# EasyEDA schematic DOAN1.json
TITLE: Gamepad; REV: 1.0; Date: 2023-03-11; Sheet: 1/1; Company: DOAN1
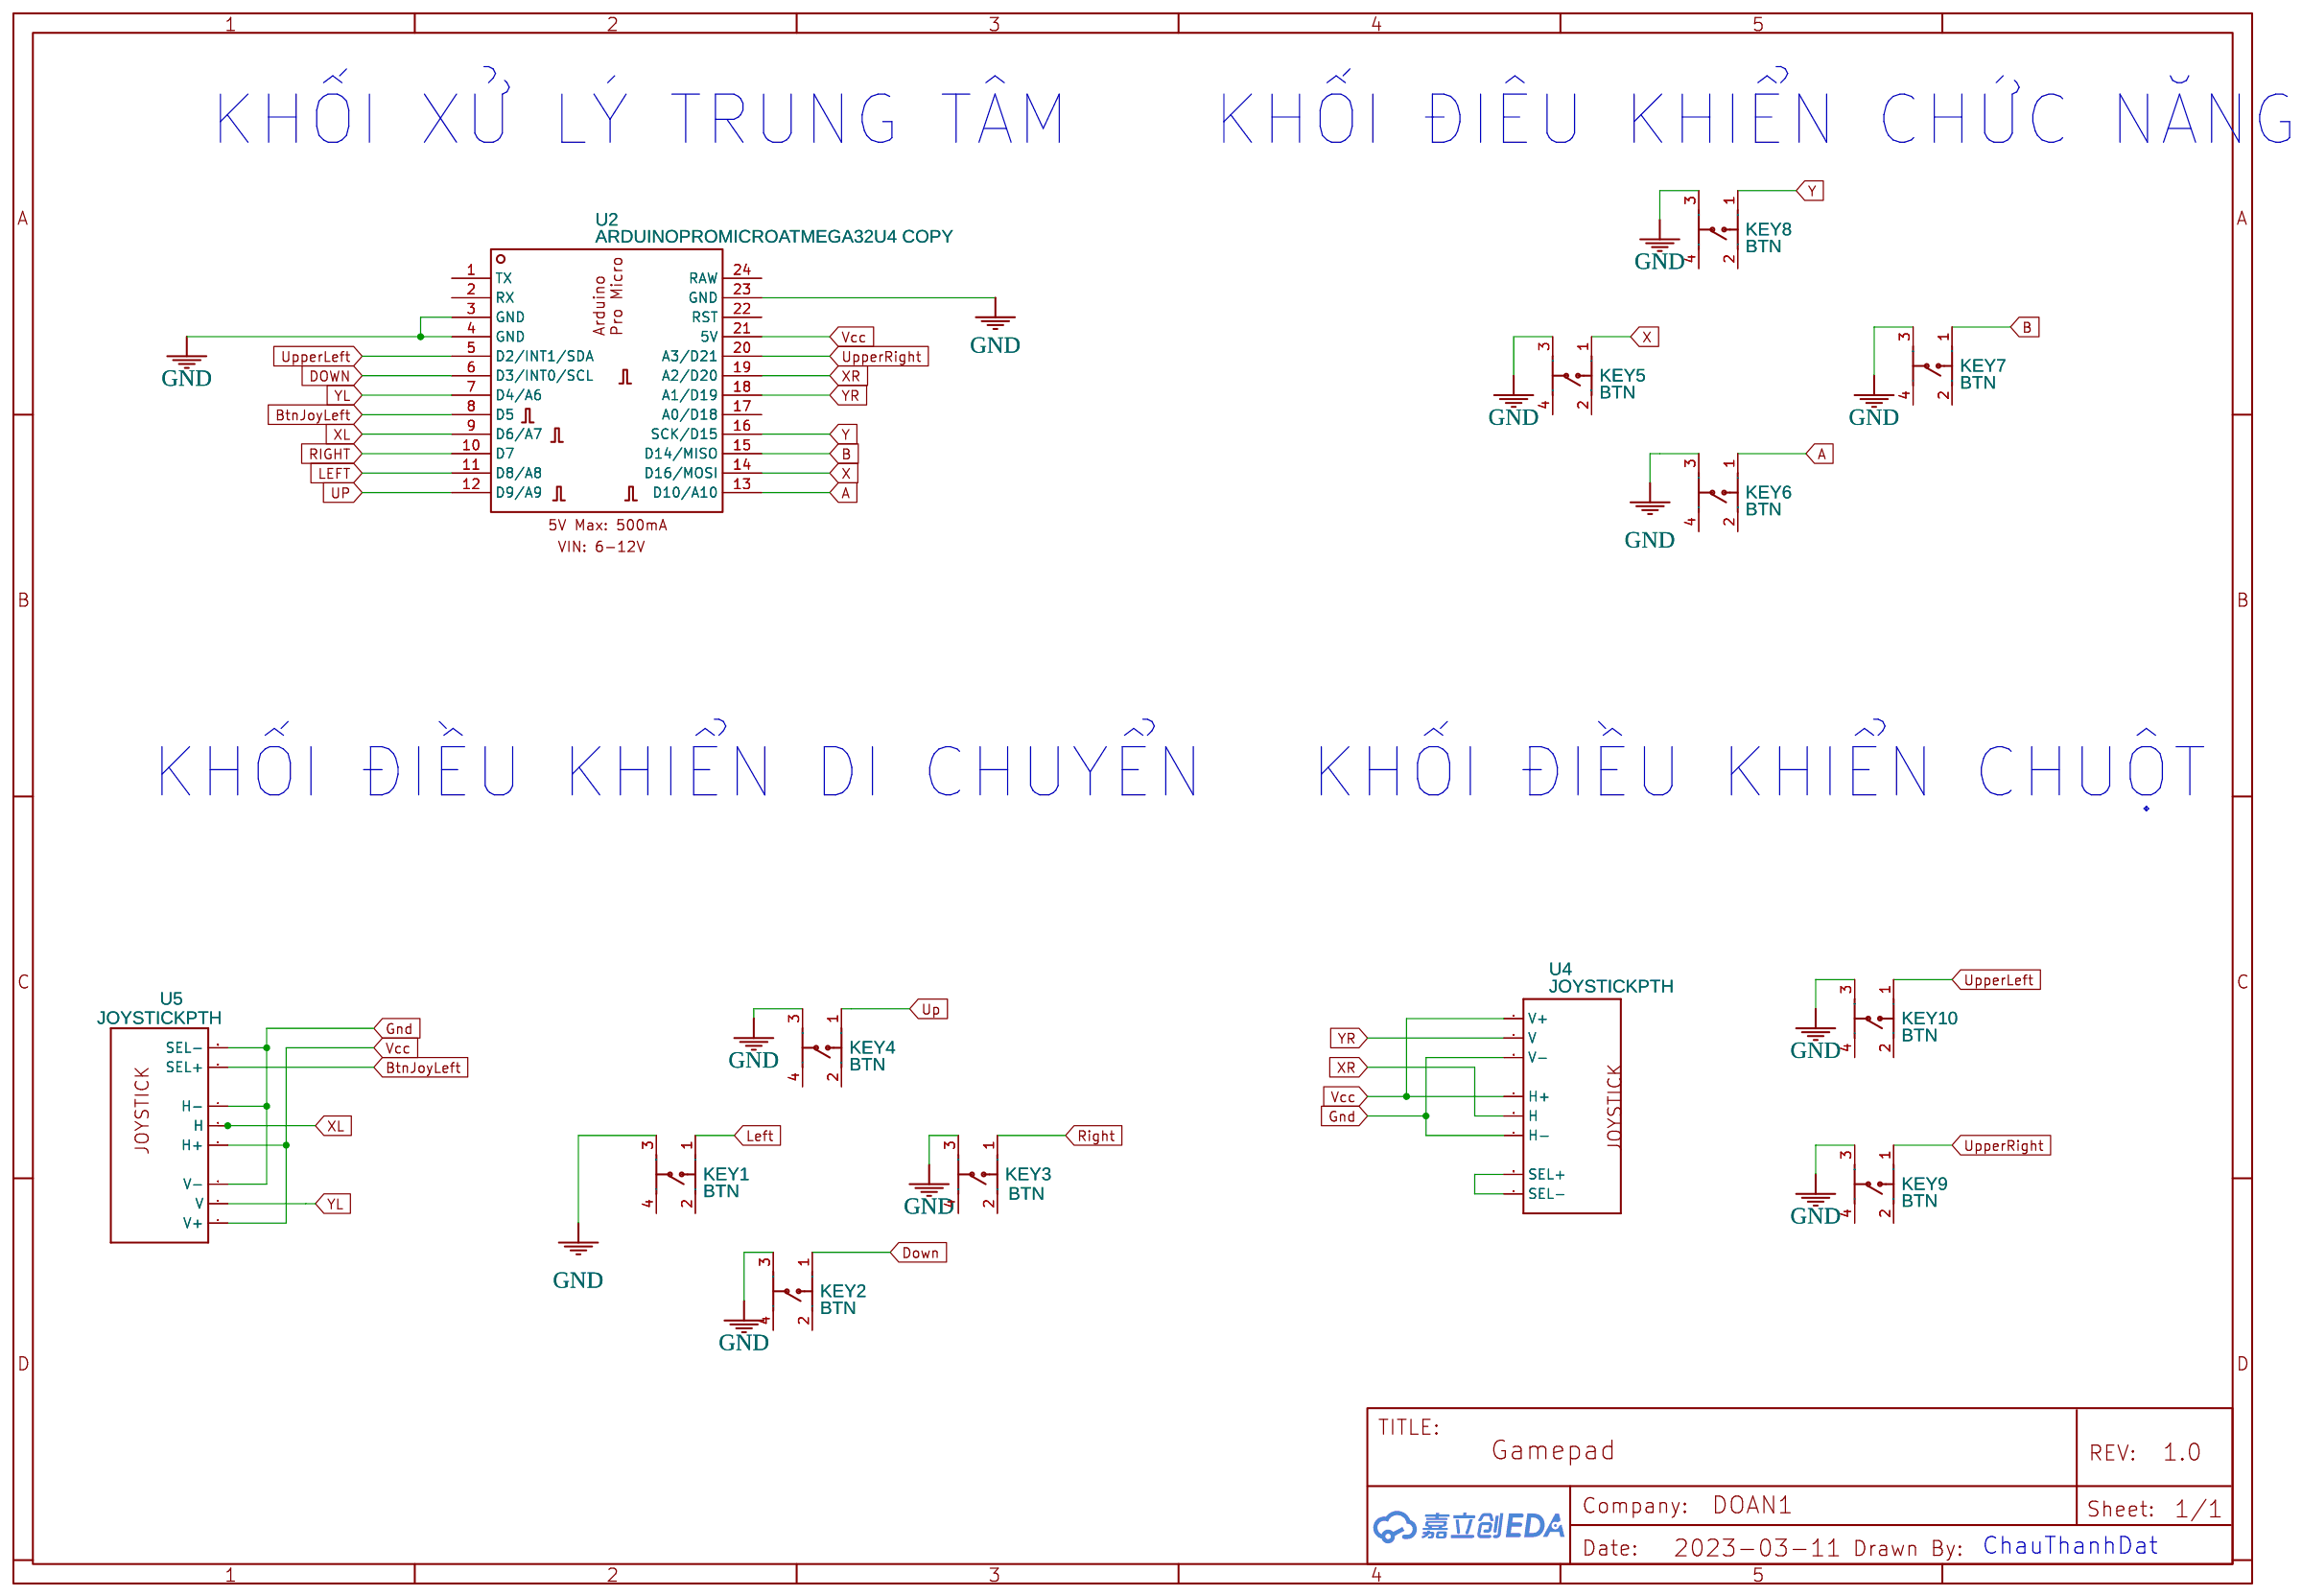
[diagram p0: schematic sheet]

## Parts
KEY1  BTN  [SW-SMD_4P-L6.0-W6.0-P4.50-LS10.0_TL3301EF160QG]
KEY2  BTN  [SW-SMD_4P-L6.0-W6.0-P4.50-LS10.0_TL3301EF160QG]
KEY3  BTN  [SW-SMD_4P-L6.0-W6.0-P4.50-LS10.0_TL3301EF160QG]
KEY4  BTN  [SW-SMD_4P-L6.0-W6.0-P4.50-LS10.0_TL3301EF160QG]
KEY5  BTN  [SW-SMD_4P-L6.0-W6.0-P4.50-LS10.0_TL3301EF160QG]
KEY6  BTN  [SW-SMD_4P-L6.0-W6.0-P4.50-LS10.0_TL3301EF160QG]
KEY7  BTN  [SW-SMD_4P-L6.0-W6.0-P4.50-LS10.0_TL3301EF160QG]
KEY8  BTN  [SW-SMD_4P-L6.0-W6.0-P4.50-LS10.0_TL3301EF160QG]
KEY9  BTN  [SW-SMD_4P-L6.0-W6.0-P4.50-LS10.0_TL3301EF160QG]
KEY10  BTN  [SW-SMD_4P-L6.0-W6.0-P4.50-LS10.0_TL3301EF160QG]
U2  ARDUINOPROMICROATMEGA32U4 COPY  [ARDUINOPROMICRO]
U4  JOYSTICKPTH  [JOYSTICK]
U5  JOYSTICKPTH  [JOYSTICK]

## Library data of the parts
KEY1-KEY10 = 4PINTACTPCBTHTPUSHBUTTON: Supplier: LCSC; Supplier Part: C9900003768; Manufacturer: null; Manufacturer Part: 4pinTACTPCBTHTPushButton; Contributor: LCSC; JLCPCB Part Class: Extended Part
U2 = ARDUINOPROMICROATMEGA32U4 COPY: Contributor: BauerTechnology
U4 U5 = JOYSTICKPTH: Thumb Joystick; Contributor: SparkFun

## Nets
Gnd: U4.H3(H-) U4.V3(V-) U5.B2A(SEL-) U5.H3(H-) U5.V3(V-)
GND: KEY1.3 KEY2.3 KEY3.3 KEY4.3 KEY5.3 KEY6.3 KEY7.3 KEY8.3 KEY9.3 KEY10.3 U2.3(GND) U2.4(GND) U2.23(GND)
Vcc: U2.21(5V) U4.H1(H+) U4.V1(V+) U5.H1(H+) U5.V1(V+)
A: KEY6.1 U2.13(D10/A10)
B: KEY7.1 U2.15(D14/MISO)
BtnJoyLeft: U2.8(D5) U5.B1A(SEL+)
DOWN: U2.6(D3/INT0/SCL)
Down: KEY2.1
LEFT: U2.11(D8/A8)
Left: KEY1.1
RIGHT: U2.10(D7)
Right: KEY3.1
UP: U2.12(D9/A9)
Up: KEY4.1
UpperLeft: KEY10.1 U2.5(D2/INT1/SDA)
UpperRight: KEY9.1 U2.20(A3/D21)
X: KEY5.1 U2.14(D16/MOSI)
XL: U2.9(D6/A7) U5.H2(H)
XR: U2.19(A2/D20) U4.H2(H)
Y: KEY8.1 U2.16(SCK/D15)
YL: U2.7(D4/A6) U5.V2(V)
YR: U2.18(A1/D19) U4.V2(V)
Net-(U4-B1A): U4.B1A(SEL+) U4.B2A(SEL-)

Not connected (* = marked no-connect by the designer): KEY1 2 4; KEY2 2 4; KEY3 2 4; KEY4 2 4; KEY5 2 4; KEY6 2 4; KEY7 2 4; KEY8 2 4; KEY9 2 4; KEY10 2 4; U2 1(TX) 2(RX) 17(A0/D18) 22(RST) 24(RAW)

## Notes on the sheet
- KHỐI XỬ LÝ TRUNG TÂM
- KHỐI ĐIÊU KHIỂN CHỨC NĂNG
- KHỐI ĐIỀU KHIỂN DI CHUYỂN
- KHỐI ĐIỀU KHIỂN CHUỘT
- ChauThanhDat
